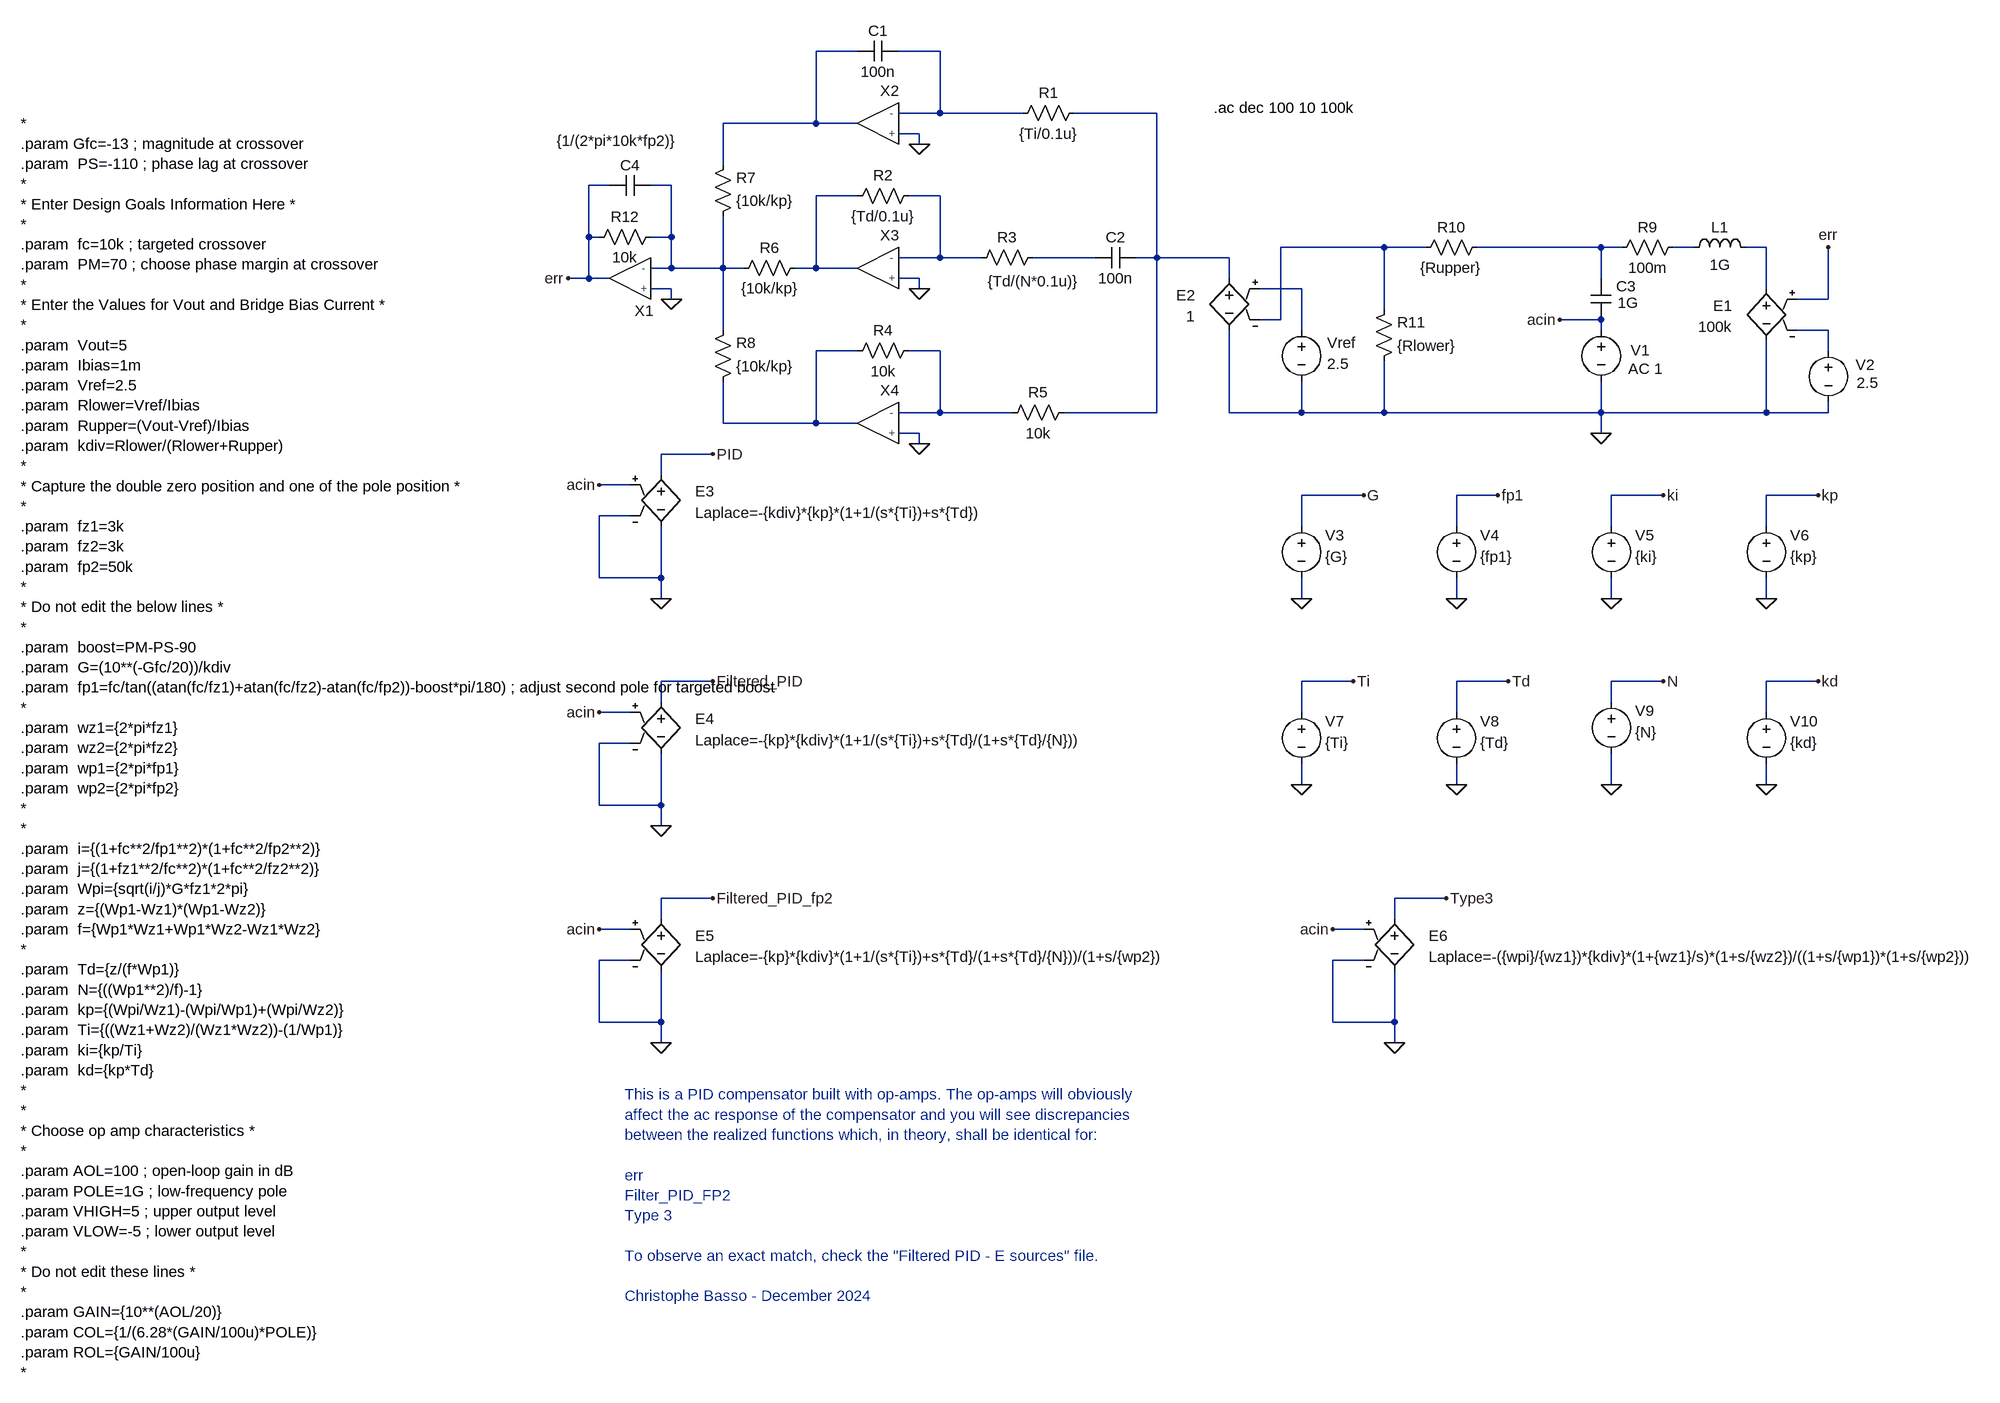
[diagram p0: schematic Filtered PID - op amps.asc]
Filtered PID - op amps.asc, the LTspice schematic file:
Version 4
SHEET 1 2232 2244
WIRE 256 -112 192 -112
WIRE 384 -112 320 -112
WIRE 384 -16 384 -112
WIRE 384 -16 320 -16
WIRE 512 -16 384 -16
WIRE 720 -16 592 -16
WIRE 192 0 192 -112
WIRE 192 0 48 0
WIRE 256 0 192 0
WIRE 352 16 320 16
WIRE 352 32 352 16
WIRE 48 64 48 0
WIRE -128 96 -160 96
WIRE -32 96 -64 96
WIRE 256 112 192 112
WIRE 384 112 336 112
WIRE -160 176 -160 96
WIRE -144 176 -160 176
WIRE -32 176 -32 96
WIRE -32 176 -64 176
WIRE 1072 192 912 192
WIRE 1136 192 1072 192
WIRE 1408 192 1216 192
WIRE 1440 192 1408 192
WIRE 1552 192 1520 192
WIRE 1664 192 1632 192
WIRE 384 208 384 112
WIRE 384 208 320 208
WIRE 448 208 384 208
WIRE 624 208 528 208
WIRE 720 208 720 -16
WIRE 720 208 688 208
WIRE 832 208 720 208
WIRE -32 224 -32 176
WIRE -32 224 -64 224
WIRE 48 224 48 144
WIRE 48 224 -32 224
WIRE 80 224 48 224
WIRE 192 224 192 112
WIRE 192 224 160 224
WIRE 256 224 192 224
WIRE -160 240 -160 176
WIRE -160 240 -192 240
WIRE -128 240 -160 240
WIRE 352 240 320 240
WIRE 832 240 832 208
WIRE 1408 240 1408 192
WIRE -32 256 -64 256
WIRE 352 256 352 240
WIRE 944 256 880 256
WIRE 1664 256 1664 192
WIRE -32 272 -32 256
WIRE 1760 272 1760 192
WIRE 1760 272 1712 272
WIRE 1072 288 1072 192
WIRE 912 304 912 192
WIRE 912 304 880 304
WIRE 1408 304 1344 304
WIRE 48 320 48 224
WIRE 944 320 944 256
WIRE 1408 320 1408 304
WIRE 1760 320 1712 320
WIRE 256 352 192 352
WIRE 384 352 336 352
WIRE 1760 352 1760 320
WIRE 384 448 384 352
WIRE 384 448 320 448
WIRE 496 448 384 448
WIRE 720 448 720 208
WIRE 720 448 576 448
WIRE 832 448 832 320
WIRE 944 448 944 400
WIRE 944 448 832 448
WIRE 1072 448 1072 368
WIRE 1072 448 944 448
WIRE 1408 448 1408 400
WIRE 1408 448 1072 448
WIRE 1664 448 1664 336
WIRE 1664 448 1408 448
WIRE 1760 448 1760 432
WIRE 1760 448 1664 448
WIRE 48 464 48 400
WIRE 192 464 192 352
WIRE 192 464 48 464
WIRE 256 464 192 464
WIRE 352 480 320 480
WIRE 1408 480 1408 448
WIRE 352 496 352 480
WIRE 32 512 -48 512
WIRE -48 544 -48 512
WIRE -96 560 -144 560
WIRE 1040 576 944 576
WIRE 1248 576 1184 576
WIRE 1504 576 1424 576
WIRE 1744 576 1664 576
WIRE -96 608 -144 608
WIRE 944 624 944 576
WIRE 1184 624 1184 576
WIRE 1424 624 1424 576
WIRE 1664 624 1664 576
WIRE -144 704 -144 608
WIRE -48 704 -48 624
WIRE -48 704 -144 704
WIRE -48 736 -48 704
WIRE 944 736 944 704
WIRE 1184 736 1184 704
WIRE 1424 736 1424 704
WIRE 1664 736 1664 704
WIRE 32 864 -48 864
WIRE 1024 864 944 864
WIRE 1264 864 1184 864
WIRE 1504 864 1424 864
WIRE 1744 864 1664 864
WIRE -48 896 -48 864
WIRE 1424 896 1424 864
WIRE -96 912 -144 912
WIRE 944 912 944 864
WIRE 1184 912 1184 864
WIRE 1664 912 1664 864
WIRE -96 960 -144 960
WIRE 944 1024 944 992
WIRE 1184 1024 1184 992
WIRE 1424 1024 1424 976
WIRE 1664 1024 1664 992
WIRE -144 1056 -144 960
WIRE -48 1056 -48 976
WIRE -48 1056 -144 1056
WIRE -48 1088 -48 1056
WIRE 32 1200 -48 1200
WIRE 1168 1200 1088 1200
WIRE -48 1232 -48 1200
WIRE 1088 1232 1088 1200
WIRE -96 1248 -144 1248
WIRE 1040 1248 992 1248
WIRE -96 1296 -144 1296
WIRE 1040 1296 992 1296
WIRE -144 1392 -144 1296
WIRE -48 1392 -48 1312
WIRE -48 1392 -144 1392
WIRE 992 1392 992 1296
WIRE 1088 1392 1088 1312
WIRE 1088 1392 992 1392
WIRE -48 1424 -48 1392
WIRE 1088 1424 1088 1392
FLAG 352 32 0
FLAG 352 256 0
FLAG 352 496 0
FLAG -32 272 0
FLAG -192 240 err
FLAG 1760 192 err
FLAG 1408 480 0
FLAG 1040 576 G
FLAG 944 736 0
FLAG 1248 576 fp1
FLAG 1184 736 0
FLAG 1504 576 ki
FLAG 1424 736 0
FLAG 1744 576 kp
FLAG 1664 736 0
FLAG 1024 864 Ti
FLAG 944 1024 0
FLAG 1264 864 Td
FLAG 1184 1024 0
FLAG 1504 864 N
FLAG 1424 1024 0
FLAG 1744 864 kd
FLAG 1664 1024 0
FLAG 1344 304 acin
FLAG -48 736 0
FLAG 32 512 PID
FLAG -144 560 acin
FLAG -48 1088 0
FLAG 32 864 Filtered_PID
FLAG -144 912 acin
FLAG -48 1424 0
FLAG 32 1200 Filtered_PID_fp2
FLAG -144 1248 acin
FLAG 1088 1424 0
FLAG 1168 1200 Type3
FLAG 992 1248 acin
DATAFLAG 1328 192 ""
DATAFLAG 944 576 ""
DATAFLAG 1184 576 ""
DATAFLAG 1424 576 ""
DATAFLAG 1664 576 ""
DATAFLAG 976 864 ""
DATAFLAG 1184 864 ""
DATAFLAG 1456 864 ""
DATAFLAG 1664 864 ""
SYMBOL opampTOF -128 224 M0
WINDOW 0 -54 82 Bottom 2
SYMATTR InstName X1
SYMATTR SpiceLine Vhigh={VHIGH} Vlow={VLOW} Col={COL} Rol={ROL}
SYMBOL cap 320 -128 R90
WINDOW 0 0 32 VBottom 2
WINDOW 3 32 32 VTop 2
SYMATTR InstName C1
SYMATTR Value 100n
SYMBOL res 608 -32 R90
WINDOW 0 0 56 VBottom 2
WINDOW 3 32 56 VTop 2
SYMATTR InstName R1
SYMATTR Value {Ti/0.1u}
SYMBOL res 352 96 R90
WINDOW 0 0 56 VBottom 2
WINDOW 3 32 56 VTop 2
SYMATTR InstName R2
SYMATTR Value {Td/0.1u}
SYMBOL res 544 192 R90
WINDOW 0 0 56 VBottom 2
WINDOW 3 37 15 VTop 2
SYMATTR InstName R3
SYMATTR Value {Td/(N*0.1u)}
SYMBOL cap 688 192 R90
WINDOW 0 0 32 VBottom 2
WINDOW 3 32 32 VTop 2
SYMATTR InstName C2
SYMATTR Value 100n
SYMBOL res 352 336 R90
WINDOW 0 0 56 VBottom 2
WINDOW 3 32 56 VTop 2
SYMATTR InstName R4
SYMATTR Value 10k
SYMBOL res 592 432 R90
WINDOW 0 0 56 VBottom 2
WINDOW 3 32 56 VTop 2
SYMATTR InstName R5
SYMATTR Value 10k
SYMBOL res 176 208 R90
WINDOW 0 0 56 VBottom 2
WINDOW 3 32 56 VTop 2
SYMATTR InstName R6
SYMATTR Value {10k/kp}
SYMBOL res 32 160 M180
WINDOW 0 36 76 Left 2
WINDOW 3 36 40 Left 2
SYMATTR InstName R7
SYMATTR Value {10k/kp}
SYMBOL res 32 416 M180
WINDOW 0 36 76 Left 2
WINDOW 3 36 40 Left 2
SYMATTR InstName R8
SYMATTR Value {10k/kp}
SYMBOL voltage 944 304 R0
WINDOW 0 40 36 Left 2
WINDOW 3 40 68 Left 2
SYMATTR InstName Vref
SYMATTR Value 2.5
SYMBOL e 1664 240 M0
WINDOW 0 53 42 Left 2
WINDOW 3 53 75 Left 2
SYMATTR InstName E1
SYMATTR Value 100k
SYMBOL ind 1536 208 R270
WINDOW 0 32 56 VTop 2
WINDOW 3 5 56 VBottom 2
SYMATTR InstName L1
SYMATTR Value 1G
SYMBOL res 1536 176 R90
WINDOW 0 0 56 VBottom 2
WINDOW 3 32 56 VTop 2
SYMATTR InstName R9
SYMATTR Value 100m
SYMBOL cap 1392 240 R0
WINDOW 0 39 12 Left 2
WINDOW 3 42 38 Left 2
SYMATTR InstName C3
SYMATTR Value 1G
SYMBOL voltage 1408 304 R0
WINDOW 0 46 47 Left 2
WINDOW 123 42 76 Left 2
WINDOW 39 0 0 Left 0
SYMATTR InstName V1
SYMATTR Value2 AC 1
SYMATTR Value ""
SYMBOL voltage 1760 336 R0
WINDOW 0 42 38 Left 2
WINDOW 3 44 66 Left 2
SYMATTR InstName V2
SYMATTR Value 2.5
SYMBOL res 1232 176 R90
WINDOW 0 0 56 VBottom 2
WINDOW 3 32 56 VTop 2
SYMATTR InstName R10
SYMATTR Value {Rupper}
SYMBOL res 1056 384 M180
WINDOW 0 36 76 Left 2
WINDOW 3 36 40 Left 2
SYMATTR InstName R11
SYMATTR Value {Rlower}
SYMBOL opampTOF 256 -16 M0
WINDOW 0 -50 -19 Bottom 2
SYMATTR InstName X2
SYMATTR SpiceLine Vhigh={VHIGH} Vlow={VLOW} Col={COL} Rol={ROL}
SYMBOL opampTOF 256 208 M0
WINDOW 0 -50 -19 Bottom 2
SYMATTR InstName X3
SYMATTR SpiceLine Vhigh={VHIGH} Vlow={VLOW} Col={COL} Rol={ROL}
SYMBOL opampTOF 256 448 M0
WINDOW 0 -50 -19 Bottom 2
SYMATTR InstName X4
SYMATTR SpiceLine Vhigh={VHIGH} Vlow={VLOW} Col={COL} Rol={ROL}
SYMBOL voltage 944 608 R0
WINDOW 0 37 30 Left 2
WINDOW 3 37 63 Left 2
SYMATTR InstName V3
SYMATTR Value {G}
SYMBOL voltage 1184 608 R0
WINDOW 0 37 30 Left 2
WINDOW 3 37 63 Left 2
SYMATTR InstName V4
SYMATTR Value {fp1}
SYMBOL voltage 1424 608 R0
WINDOW 0 37 30 Left 2
WINDOW 3 37 63 Left 2
SYMATTR InstName V5
SYMATTR Value {ki}
SYMBOL voltage 1664 608 R0
WINDOW 0 37 30 Left 2
WINDOW 3 37 63 Left 2
SYMATTR InstName V6
SYMATTR Value {kp}
SYMBOL voltage 944 896 R0
WINDOW 0 37 30 Left 2
WINDOW 3 37 63 Left 2
SYMATTR InstName V7
SYMATTR Value {Ti}
SYMBOL voltage 1184 896 R0
WINDOW 0 37 30 Left 2
WINDOW 3 37 63 Left 2
SYMATTR InstName V8
SYMATTR Value {Td}
SYMBOL voltage 1424 880 R0
WINDOW 0 37 30 Left 2
WINDOW 3 37 63 Left 2
SYMATTR InstName V9
SYMATTR Value {N}
SYMBOL res -48 160 R90
WINDOW 0 0 56 VBottom 2
WINDOW 3 32 56 VTop 2
SYMATTR InstName R12
SYMATTR Value 10k
SYMBOL cap -64 80 R90
WINDOW 0 0 32 VBottom 2
WINDOW 3 -69 53 VTop 2
SYMATTR InstName C4
SYMATTR Value {1/(2*pi*10k*fp2)}
SYMBOL voltage 1664 896 R0
WINDOW 0 37 30 Left 2
WINDOW 3 37 63 Left 2
SYMATTR InstName V10
SYMATTR Value {kd}
SYMBOL e 832 224 M0
WINDOW 0 53 42 Left 2
WINDOW 3 53 75 Left 2
SYMATTR InstName E2
SYMATTR Value 1
SYMBOL e -48 528 R0
WINDOW 0 53 42 Left 2
WINDOW 3 53 75 Left 2
SYMATTR InstName E3
SYMATTR Value Laplace=-{kdiv}*{kp}*(1+1/(s*{Ti})+s*{Td})
SYMBOL e -48 880 R0
WINDOW 0 53 42 Left 2
WINDOW 3 53 75 Left 2
SYMATTR InstName E4
SYMATTR Value Laplace=-{kp}*{kdiv}*(1+1/(s*{Ti})+s*{Td}/(1+s*{Td}/{N}))
SYMBOL e -48 1216 R0
WINDOW 0 53 42 Left 2
WINDOW 3 53 75 Left 2
SYMATTR InstName E5
SYMATTR Value Laplace=-{kp}*{kdiv}*(1+1/(s*{Ti})+s*{Td}/(1+s*{Td}/{N}))/(1+s/{wp2})
SYMBOL e 1088 1216 R0
WINDOW 0 53 42 Left 2
WINDOW 3 53 75 Left 2
SYMATTR InstName E6
SYMATTR Value Laplace=-({wpi}/{wz1})*{kdiv}*(1+{wz1}/s)*(1+s/{wz2})/((1+s/{wp1})*(1+s/{wp2}))
TEXT -1040 0 Left 2 !*\n.param Gfc=-13 ; magnitude at crossover\n.param  PS=-110 ; phase lag at crossover\n*\n* Enter Design Goals Information Here *\n*\n.param  fc=10k ; targeted crossover\n.param  PM=70 ; choose phase margin at crossover\n*\n* Enter the Values for Vout and Bridge Bias Current *\n*\n.param  Vout=5\n.param  Ibias=1m\n.param  Vref=2.5\n.param  Rlower=Vref/Ibias\n.param  Rupper=(Vout-Vref)/Ibias\n.param  kdiv=Rlower/(Rlower+Rupper)\n*\n* Capture the double zero position and one of the pole position *\n*\n.param  fz1=3k\n.param  fz2=3k\n.param  fp2=50k\n*\n* Do not edit the below lines *\n*\n.param  boost=PM-PS-90\n.param  G=(10**(-Gfc/20))/kdiv\n.param  fp1=fc/tan((atan(fc/fz1)+atan(fc/fz2)-atan(fc/fp2))-boost*pi/180) ; adjust second pole for targeted boost\n*\n.param  wz1={2*pi*fz1}\n.param  wz2={2*pi*fz2}\n.param  wp1={2*pi*fp1}\n.param  wp2={2*pi*fp2}\n*\n*\n.param  i={(1+fc**2/fp1**2)*(1+fc**2/fp2**2)}\n.param  j={(1+fz1**2/fc**2)*(1+fc**2/fz2**2)}\n.param  Wpi={sqrt(i/j)*G*fz1*2*pi}\n.param  z={(Wp1-Wz1)*(Wp1-Wz2)}\n.param  f={Wp1*Wz1+Wp1*Wz2-Wz1*Wz2}\n*\n.param  Td={z/(f*Wp1)}\n.param  N={((Wp1**2)/f)-1}\n.param  kp={(Wpi/Wz1)-(Wpi/Wp1)+(Wpi/Wz2)}\n.param  Ti={((Wz1+Wz2)/(Wz1*Wz2))-(1/Wp1)}\n.param  ki={kp/Ti}\n.param  kd={kp*Td}\n*\n*\n* Choose op amp characteristics *\n*\n.param AOL=100 ; open-loop gain in dB\n.param POLE=1G ; low-frequency pole\n.param VHIGH=5 ; upper output level\n.param VLOW=-5 ; lower output level\n*\n* Do not edit these lines *\n*\n.param GAIN={10**(AOL/20)}\n.param COL={1/(6.28*(GAIN/100u)*POLE)}\n.param ROL={GAIN/100u}\n*
TEXT 808 -24 Left 2 !.ac dec 100 10 100k
TEXT -104 1504 Left 2 ;This is a PID compensator built with op-amps. The op-amps will obviously\naffect the ac response of the compensator and you will see discrepancies\nbetween the realized functions which, in theory, shall be identical for:\n \nerr\nFilter_PID_FP2\nType 3\n \nTo observe an exact match, check the "Filtered PID - E sources" file.\n \nChristophe Basso - December 2024

The netlist it stands for:
* Filtered PID - op amps.asc
XX1 N004 0 err opampTOF params: Vhigh={VHIGH} Vlow={VLOW} Col={COL} Rol={ROL}  ; pins - + OUT
C1 N002 N001 100n
R1 N003 N002 {Ti/0.1u}
R2 N006 N005 {Td/0.1u}
R3 N011 N006 {Td/(N*0.1u)}
C2 N003 N011 100n
R4 N015 N014 10k
R5 N003 N015 10k
R6 N005 N004 {10k/kp}
R7 N004 N001 {10k/kp}
R8 N014 N004 {10k/kp}
Vref N012 0 2.5
E1 N010 0 err N013 100k
L1 N009 N010 1G
R9 N009 N008 100m
C3 N008 acin 1G
V1 acin 0 AC 1
V2 N013 0 2.5
R10 N008 N007 {Rupper}
R11 0 N007 {Rlower}
XX2 N002 0 N001 opampTOF params: Vhigh={VHIGH} Vlow={VLOW} Col={COL} Rol={ROL}  ; pins - + OUT
XX3 N006 0 N005 opampTOF params: Vhigh={VHIGH} Vlow={VLOW} Col={COL} Rol={ROL}  ; pins - + OUT
XX4 N015 0 N014 opampTOF params: Vhigh={VHIGH} Vlow={VLOW} Col={COL} Rol={ROL}  ; pins - + OUT
V3 G 0 {G}
V4 fp1 0 {fp1}
V5 ki 0 {ki}
V6 kp 0 {kp}
V7 Ti 0 {Ti}
V8 Td 0 {Td}
V9 N 0 {N}
R12 N004 err 10k
C4 N004 err {1/(2*pi*10k*fp2)}
V10 kd 0 {kd}
E2 N003 0 N012 N007 1
E3 PID 0 acin 0 Laplace=-{kdiv}*{kp}*(1+1/(s*{Ti})+s*{Td})
E4 Filtered_PID 0 acin 0 Laplace=-{kp}*{kdiv}*(1+1/(s*{Ti})+s*{Td}/(1+s*{Td}/{N}))
E5 Filtered_PID_fp2 0 acin 0 Laplace=-{kp}*{kdiv}*(1+1/(s*{Ti})+s*{Td}/(1+s*{Td}/{N}))/(1+s/{wp2})
E6 Type3 0 acin 0 Laplace=-({wpi}/{wz1})*{kdiv}*(1+{wz1}/s)*(1+s/{wz2})/((1+s/{wp1})*(1+s/{wp2}))
*
.param Gfc=-13 ; magnitude at crossover
.param  PS=-110 ; phase lag at crossover
*
* Enter Design Goals Information Here *
*
.param  fc=10k ; targeted crossover
.param  PM=70 ; choose phase margin at crossover
*
* Enter the Values for Vout and Bridge Bias Current *
*
.param  Vout=5
.param  Ibias=1m
.param  Vref=2.5
.param  Rlower=Vref/Ibias
.param  Rupper=(Vout-Vref)/Ibias
.param  kdiv=Rlower/(Rlower+Rupper)
*
* Capture the double zero position and one of the pole position *
*
.param  fz1=3k
.param  fz2=3k
.param  fp2=50k
*
* Do not edit the below lines *
*
.param  boost=PM-PS-90
.param  G=(10**(-Gfc/20))/kdiv
.param  fp1=fc/tan((atan(fc/fz1)+atan(fc/fz2)-atan(fc/fp2))-boost*pi/180) ; adjust second pole for targeted boost
*
.param  wz1={2*pi*fz1}
.param  wz2={2*pi*fz2}
.param  wp1={2*pi*fp1}
.param  wp2={2*pi*fp2}
*
*
.param  i={(1+fc**2/fp1**2)*(1+fc**2/fp2**2)}
.param  j={(1+fz1**2/fc**2)*(1+fc**2/fz2**2)}
.param  Wpi={sqrt(i/j)*G*fz1*2*pi}
.param  z={(Wp1-Wz1)*(Wp1-Wz2)}
.param  f={Wp1*Wz1+Wp1*Wz2-Wz1*Wz2}
*
.param  Td={z/(f*Wp1)}
.param  N={((Wp1**2)/f)-1}
.param  kp={(Wpi/Wz1)-(Wpi/Wp1)+(Wpi/Wz2)}
.param  Ti={((Wz1+Wz2)/(Wz1*Wz2))-(1/Wp1)}
.param  ki={kp/Ti}
.param  kd={kp*Td}
*
*
* Choose op amp characteristics *
*
.param AOL=100 ; open-loop gain in dB
.param POLE=1G ; low-frequency pole
.param VHIGH=5 ; upper output level
.param VLOW=-5 ; lower output level
*
* Do not edit these lines *
*
.param GAIN={10**(AOL/20)}
.param COL={1/(6.28*(GAIN/100u)*POLE)}
.param ROL={GAIN/100u}
*
.ac dec 100 10 100k
* This is a PID compensator built with op-amps. The op-amps will obviously
* affect the ac response of the compensator and you will see discrepancies
* between the realized functions which, in theory, shall be identical for:
* err
* Filter_PID_FP2
* Type 3
* To observe an exact match, check the "Filtered PID - E sources" file.
* Christophe Basso - December 2024
.backanno
.end